# Altium schematic sheet leveltranslator isolated.SchDoc
size A4
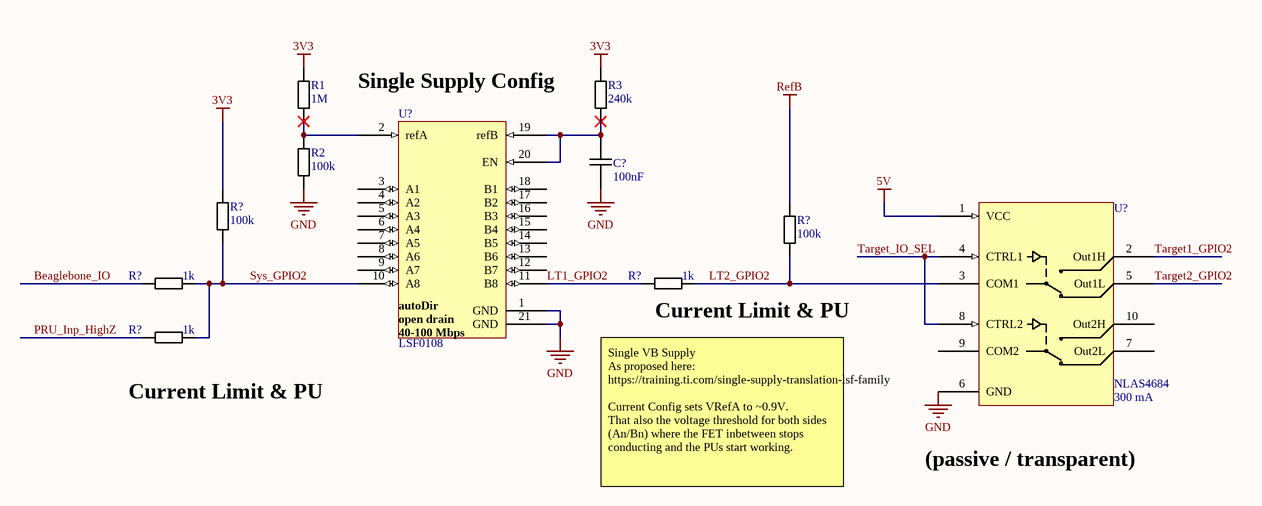
[diagram p0: leveltranslator isolated.SchDoc]

## Parts
(Parts that share a designator on the sheet are numbered #1, #2 ... from top to bottom, then left to right.)
C?  value 100nF  [CAPC1005X06]  (hidden comment: C_0402_100nF_16V)
R1  value 1M  [RESC1005X04]  (hidden comment: R_0402_1M)
R2  value 100k  [RESC1005X04]  (hidden comment: R_0402_100k_1%)
R3  value 240k  [RESC1005X04]  (hidden comment: R_0402_240k_1%)
R?#1  value 100k  [RESC1005X04]  (hidden comment: R_0402_100k_1%)
R?#2  value 100k  [RESC1005X04]  (hidden comment: R_0402_100k_1%)
R?#3  value 1k  [RESC1005X04]  (hidden comment: R_0402_1k)
R?#4  value 1k  [RESC1005X04]  (hidden comment: R_0402_1k)
R?#5  value 1k  [RESC1005X04]  (hidden comment: R_0402_1k)
U?#1  LSF0108  [QFN50P250X450X100_HS-21N]
U?#2  NLAS4684  I_max: 300 mA  [PSON50P300X100_HS-11N]

## Nets
3V3: R1.2 R3.2 R?#1.2
5V: U?#2.1(VCC)
GND: C?.1 R2.2 U?#1.1(GND) U?#1.21(GND) U?#2.6(GND)
RefB: R?#2.2
Beaglebone_IO: R?#3.1
LT1_GPIO2: R?#4.1 U?#1.11(B8)
LT2_GPIO2: R?#2.1 R?#4.2 U?#2.3(COM1)
PRU_Inp_HighZ: R?#5.1
Sys_GPIO2: R?#1.1 R?#3.2 R?#5.2 U?#1.10(A8)
Target1_GPIO2: U?#2.2(Out1H)
Target2_GPIO2: U?#2.5(Out1L)
Target_IO_SEL: U?#2.4(CTRL1) U?#2.8(CTRL2)
NetC?_2: C?.2 R3.1 U?#1.19(refB) U?#1.20(EN)
NetR1_1: R1.1 R2.1 U?#1.2(refA)

Not connected (* = marked no-connect by the designer): U?#1 3(A1) 4(A2) 5(A3) 6(A4) 7(A5) 8(A6) 9(A7) 12(B7) 13(B6) 14(B5) 15(B4) 16(B3) 17(B2) 18(B1); U?#2 7(Out2L) 9(COM2) 10(Out2H)

## Notes on the sheet
- Single Supply Config
- (near R?#4) Current Limit & PU
- (near R?#5) Current Limit & PU
- Single VB Supply
  As proposed here: https://training.ti.com/single-supply-translation-lsf-family
  Current Config sets VRefA to ~0.9V.
  That also the voltage threshold for both sides (An/Bn) where the FET inbetween stops conducting and the PUs start working.
- (passive / transparent)
- (in symbol LSF0108) autoDir / open drain / 40-100 Mbps

## Library data of the parts
C? = .C_0402_100nF_16V: Capacitor; Manufacturer: Taiyo Yuden; Manufacturer PN: EMF105B7104MVHF; V_max: 16V; Tolerance: 20%; Dielectric: X7R; Distributer: Mouser; Distributer PN: 963-EMF105B7104MVHF; Price n10 [€]: 0.03
R1 = .R_0402_1M: Resistor; Manufacturer: Panasonic; Manufacturer PN: ERJ-2GEJ105X; P_max: 100mW; V_max: 50V; Tolerance: 5%; Distributer: Mouser; Distributer PN: 667-ERJ-2GEJ105X; Price n10 [€]: 0.02
R2 R?#1 R?#2 = .R_0402_100k: Resistor; Manufacturer: Panasonic; Manufacturer PN: ERJ-2RKF1003X; P_max: 100mW; V_max: 50V; Tolerance: 1%; Distributer: Mouser; Distributer PN: 667-ERJ-2RKF1003X; Price n10 [€]: 0.02
R3 = .R_0402_240k_1%: Resistor 100ppm/C; Manufacturer: Panasonic; Manufacturer PN: ERJ-2RKF2403X; P_max: 100mW; V_max: 50V; Tolerance: 1%; Distributer: Mouser; Distributer PN: 667-ERJ-2RKF2403X; Price n10 [€]: 0.02
R?#3-R?#5 = .R_0402_1k: Resistor; Manufacturer: Panasonic; Manufacturer PN: ERJ-2GEJ102X; P_max: 100mW; V_max: 50V; Tolerance: 5%; Distributer: Mouser; Distributer PN: 667-ERJ-2GEJ102X; Price n10 [€]: 0.02
U?#1 = LSF0108: Level Translator, 8CH, auto direction sensing, open drain, VCCA 1.2-3.6V, VCCB 1.65-5.5V, 40-110 Mbps, 1-5uA leakage; Manufacturer: Nexperia; Manufacturer PN: LSF0108BQX; V_max: 5V; V_min: 0.95V; Distributer: Mouser; Distributer PN: 771-LSF0108BQX; Price n10 [€]: 0.59
U?#2 = NLAS4684-MN: Analog Switch, Dual SPDT, 500 mOhm Rds, 300 mA continuous, 500 mA peak, <10 nA Leakage (1 nA for -55 to 25°C); Manufacturer: ON Semi; Manufacturer PN: NLAS4684MNR2G; V_max: 5.5; V_min: 1.8V; Distributer: Mouser; Distributer PN: 863-NLAS4684MNR2G; Price n10 [€]: 0.63